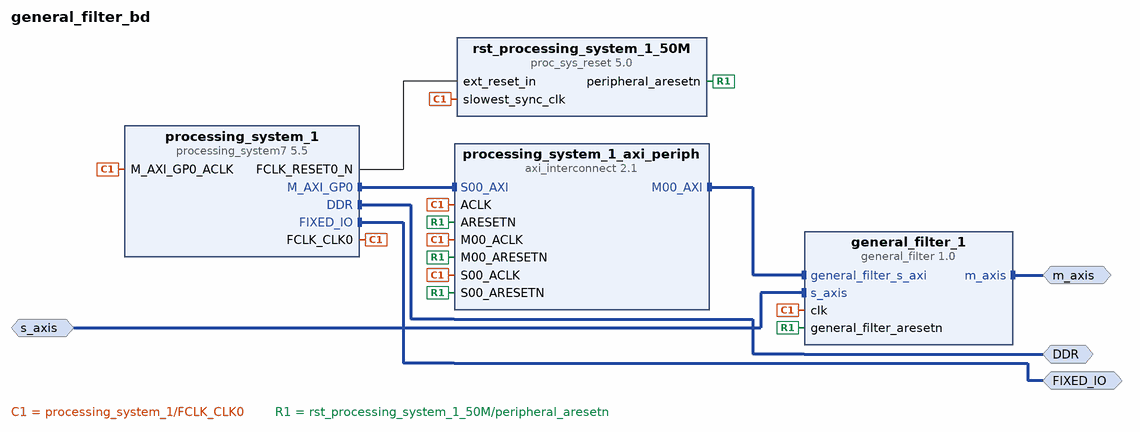
[diagram p0: block diagram of the top level]
# Vivado block design general_filter_bd, xc7z020clg400-1, Vivado 2020.2
create_bd_design general_filter_bd

create_bd_intf_port -mode Master -vlnv xilinx.com:interface:ddrx_rtl:1.0 DDR
create_bd_intf_port -mode Master -vlnv xilinx.com:display_processing_system7:fixedio_rtl:1.0 FIXED_IO
create_bd_intf_port -mode Master -vlnv xilinx.com:interface:axis_rtl:1.0 m_axis
set_property -dict {CONFIG.FREQ_HZ 50000000} [get_bd_intf_ports m_axis]
create_bd_intf_port -mode Slave -vlnv xilinx.com:interface:axis_rtl:1.0 s_axis
set_property -dict [list \
  CONFIG.FREQ_HZ 50000000 \
  CONFIG.HAS_TKEEP 0 \
  CONFIG.HAS_TLAST 1 \
  CONFIG.HAS_TREADY 1 \
  CONFIG.HAS_TSTRB 0 \
  CONFIG.LAYERED_METADATA {xilinx.com:interface:datatypes:1.0 {TDATA {datatype {name {attribs {resolve_type immediate dependency {} format string minimum {} maximum {}} value {}} bitwidth {attribs {resolve_type immediate dependency {} format long minimum {} maximum {}} value 32} bitoffset {attribs {resolve_type immediate dependency {} format long minimum {} maximum {}} value 0} real {fixed {fractwidth {attribs {resolve_type immediate dependency {} format long minimum {} maximum {}} value 0} signed {attribs {resolve_type immediate dependency {} format bool minimum {} maximum {}} value false}}}}}}} \
  CONFIG.TDATA_NUM_BYTES 4 \
  CONFIG.TDEST_WIDTH 0 \
  CONFIG.TID_WIDTH 0 \
  CONFIG.TUSER_WIDTH 0 \
] [get_bd_intf_ports s_axis]

create_bd_cell -type ip -vlnv strath.ac.uk:SysGen:general_filter:1.0 general_filter_1
create_bd_cell -type ip -vlnv xilinx.com:ip:processing_system7:5.5 processing_system_1
# 33 more settings of processing_system_1 are not shown: defaults, MIO pin electricals, DDR timing, and values the tool derives
create_bd_cell -type ip -vlnv xilinx.com:ip:axi_interconnect:2.1 processing_system_1_axi_periph
set_property -dict {CONFIG.NUM_MI 1} [get_bd_cells processing_system_1_axi_periph]
create_bd_cell -type ip -vlnv xilinx.com:ip:proc_sys_reset:5.0 rst_processing_system_1_50M

# ---- connections ----

connect_bd_intf_net [get_bd_intf_ports DDR] [get_bd_intf_pins processing_system_1/DDR]
connect_bd_intf_net [get_bd_intf_ports FIXED_IO] [get_bd_intf_pins processing_system_1/FIXED_IO]
connect_bd_intf_net [get_bd_intf_pins processing_system_1/M_AXI_GP0] [get_bd_intf_pins processing_system_1_axi_periph/S00_AXI]
connect_bd_intf_net [get_bd_intf_pins processing_system_1_axi_periph/M00_AXI] [get_bd_intf_pins general_filter_1/general_filter_s_axi]
connect_bd_intf_net [get_bd_intf_ports s_axis] [get_bd_intf_pins general_filter_1/s_axis]
connect_bd_intf_net [get_bd_intf_ports m_axis] [get_bd_intf_pins general_filter_1/m_axis]
connect_bd_net [get_bd_pins processing_system_1/FCLK_CLK0] \
  [get_bd_pins processing_system_1/M_AXI_GP0_ACLK] [get_bd_pins processing_system_1_axi_periph/S00_ACLK] \
  [get_bd_pins rst_processing_system_1_50M/slowest_sync_clk] [get_bd_pins general_filter_1/clk] \
  [get_bd_pins processing_system_1_axi_periph/M00_ACLK] [get_bd_pins processing_system_1_axi_periph/ACLK]
connect_bd_net [get_bd_pins processing_system_1/FCLK_RESET0_N] [get_bd_pins rst_processing_system_1_50M/ext_reset_in]
connect_bd_net [get_bd_pins rst_processing_system_1_50M/peripheral_aresetn] \
  [get_bd_pins processing_system_1_axi_periph/S00_ARESETN] [get_bd_pins general_filter_1/general_filter_aresetn] \
  [get_bd_pins processing_system_1_axi_periph/M00_ARESETN] [get_bd_pins processing_system_1_axi_periph/ARESETN]

# ---- address map ----
assign_bd_address -offset 0x43C00000 -range 64K -target_address_space [get_bd_addr_spaces processing_system_1/Data] [get_bd_addr_segs general_filter_1/general_filter_s_axi/reg0]

validate_bd_design
save_bd_design
